# EAGLE design XR_Preamp (EAGLE 7.6.0)

## Sheet 1 of 2
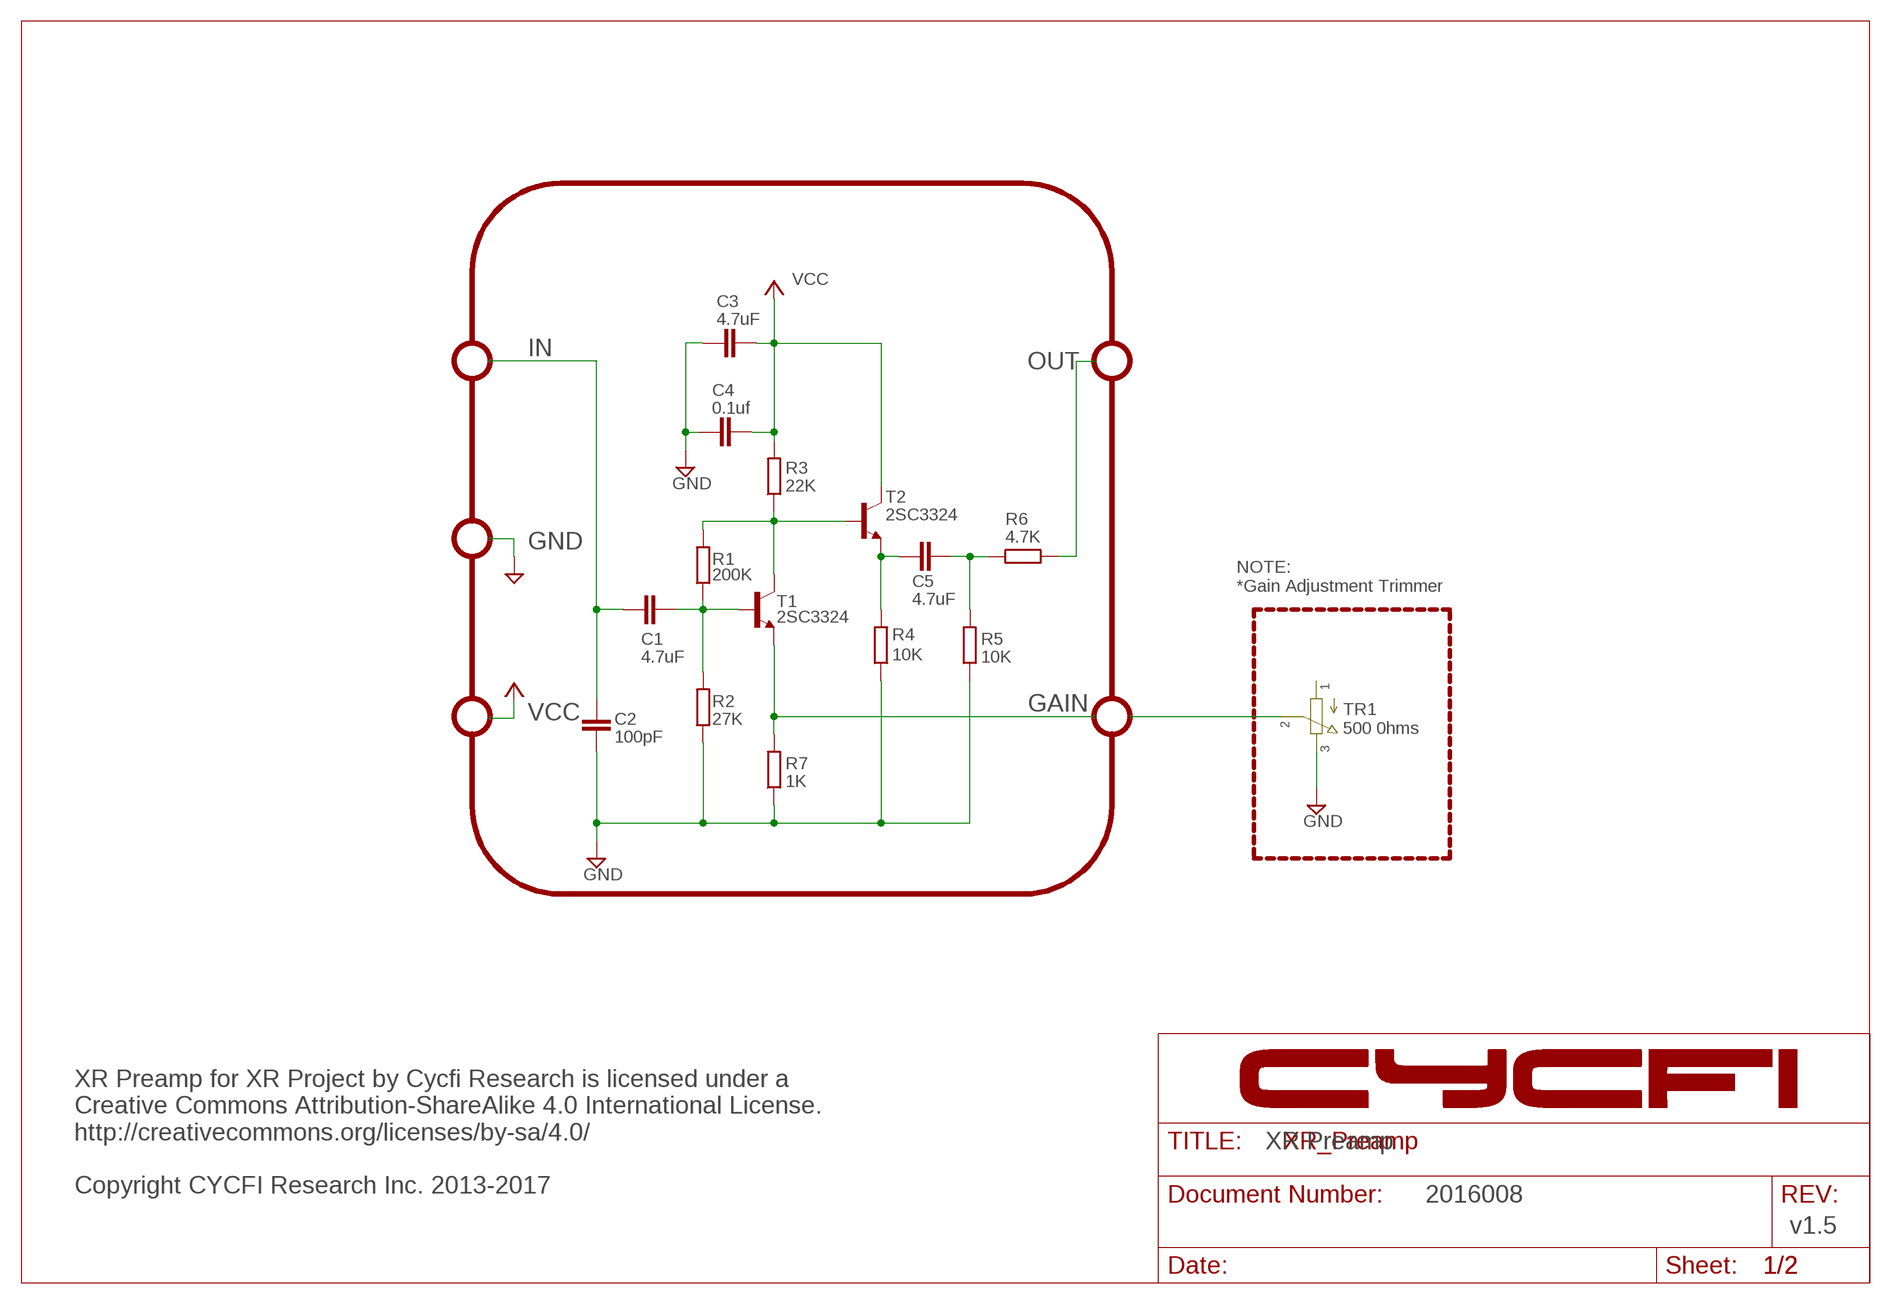
[diagram p0: schematic, sheet 1]

### Parts
C1  4.7uF  C-EUC0603  [C0603]
C2  100pF  C-EUC0402  [C0402]
C3  4.7uF  C-EUC0603  [C0603]
C4  0.1uf  C-EUC0402  [C0402]
C5  4.7uF  C-EUC0402  [C0402]
R1  200K  R-EU_R0402  [R0402]
R2  27K  R-EU_R0402  [R0402]
R3  22K  R-EU_R0402  [R0402]
R4  10K  R-EU_R0402  [R0402]
R5  10K  R-EU_R0402  [R0402]
R6  4.7K  R-EU_R0402  [R0402]
R7  1K  R-EU_R0402  [R0402]
T1  2SC3324  BC846  [SOT23]
T2  2SC3324  BC846  [SOT23]

### Nets
GAIN: R7.2 T1.2(E) ; also sheet 2
GND: C2.1 C3.1 C4.1 R2.1 R4.1 R5.1 R7.1 ; also sheet 2
IN: C1.1 C2.2 ; also sheet 2
N$1: C1.2 R1.1 R2.2 T1.1(B)
N$3: C5.2 R4.2 T2.2(E)
OUT: R6.2 ; also sheet 2
OUT1: C5.1 R5.2 R6.1
VCC: C3.2 C4.2 R3.2 T2.3(C) ; also sheet 2
VCVF: R1.2 R3.1 T1.3(C) T2.1(B)

### Notes on the sheet
- NOTE:
  *Gain Adjustment Trimmer
- 1
- 2
- TR1
  500 0hms
- 3
- XR Preamp
- XR Preamp for XR Project by Cycfi Research is licensed under a
  Creative Commons Attribution-ShareAlike 4.0 International License.
  http://creativecommons.org/licenses/by-sa/4.0/
  
  Copyright CYCFI Research Inc. 2013-2017
- 2016008
- v1.5
- 1/2

## Sheet 2 of 2
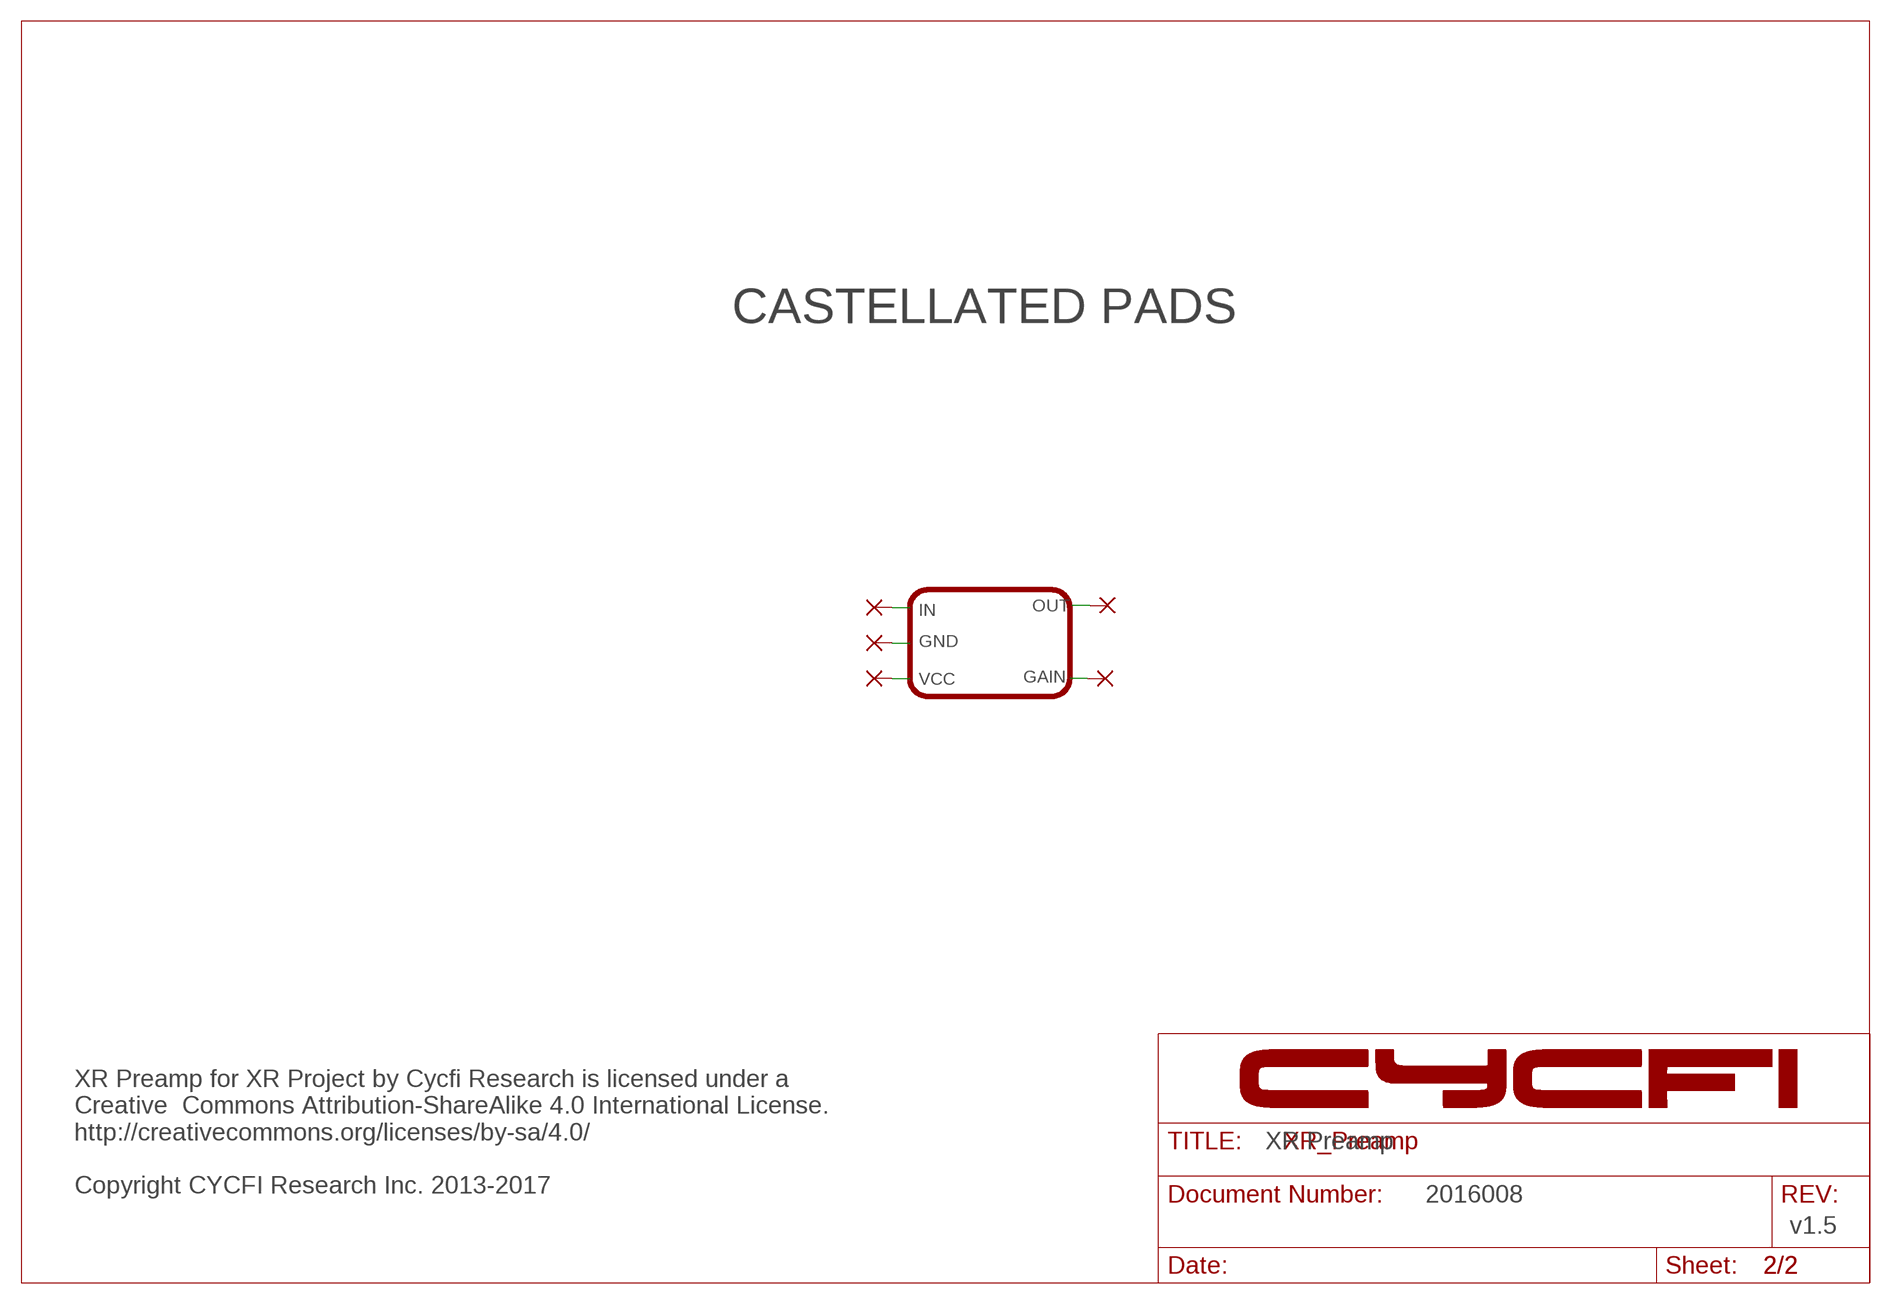
[diagram p1: schematic, sheet 2]

### Parts
PAD1  WIREPAD2,15/1,0  1,6/0,8  [1,6/0,8]
PAD2  WIREPAD2,15/1,0  1,6/0,8  [1,6/0,8]
PAD3  WIREPAD2,15/1,0  1,6/0,8  [1,6/0,8]
PAD4  WIREPAD2,15/1,0  1,6/0,8  [1,6/0,8]
PAD5  WIREPAD2,15/1,0  1,6/0,8  [1,6/0,8]

### Nets
GAIN: PAD1.1(P) ; also sheet 1
GND: PAD2.1(P) ; also sheet 1
IN: PAD3.1(P) ; also sheet 1
OUT: PAD5.1(P) ; also sheet 1
VCC: PAD4.1(P) ; also sheet 1

### Notes on the sheet
- CASTELLATED PADS
- GND
- VCC
- XR Preamp
- XR Preamp for XR Project by Cycfi Research is licensed under a
  Creative  Commons Attribution-ShareAlike 4.0 International License. 
  http://creativecommons.org/licenses/by-sa/4.0/
  
  Copyright CYCFI Research Inc. 2013-2017
- 2016008
- v1.5
- 2/2

## Library data of the parts
C1-C5 = resistor:C-EU: CAPACITOR, European symbol
PAD1-PAD5 = wirepad:1,6/0,8: THROUGH-HOLE PAD
R1-R7 = resistor:R-EU_: RESISTOR, European symbol
T1 T2 = transistor:BC846: NPN TRANSISTOR

## Board
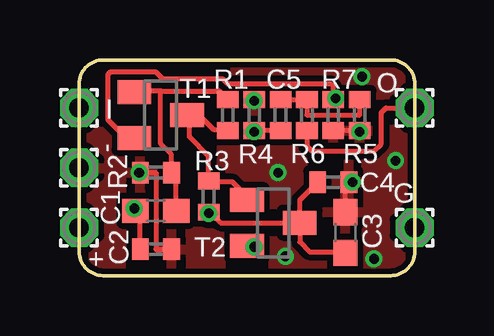
[diagram p2: board, top side]
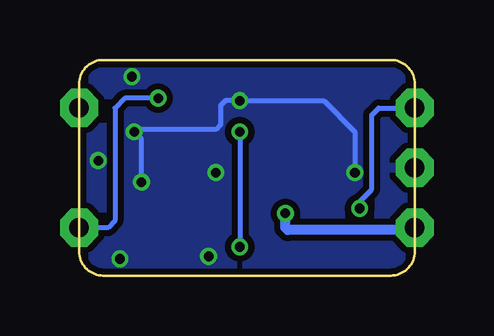
[diagram p3: board, bottom side, seen from below]

Size 14 x 9 mm. Coordinates in mm from the lower left corner, seen from the top.
Outline: 0,8 0,1 arc90 1,0 13,0 arc90 14,1 14,8 arc90 13,9 1,9 arc90 0,8
Copper layers (1*16): Top 0.035mm / dielectric 1.5mm / Bottom 0.035mm
Design rules "Fusion_eagle_rule_v1.1": minimum track width 6mil, minimum drill 12mil, track to track 6mil, track to pad 6mil, pad to pad 6mil, via to via 6mil, smd to smd 0mil, copper to edge 10mil, drill to drill 10mil, minimum pad ring 10mil, minimum via ring 6mil, stop-mask expansion 2mil, vias tented up to drill 100mil, thermal gap 10mil

### Footprints (pad centres in the part's own frame; a part is rotated, then mirrored left to right if it is on the bottom)
C0603 = smd 1.1 x 1: 1 -0.85,0; 2 0.85,0
C0402 = smd 0.7 x 0.9: 1 -0.65,0; 2 0.65,0
1,6/0,8 = drill 0.813 pad 1.6 octagon: 1 0,0
R0402 = smd 0.7 x 0.9: 1 -0.65,0; 2 0.65,0
SOT23 = smd 1 x 1.4: 1 -0.95,-1.1; 2 0.95,-1.1; 3 0,1.1

### Placement (x,y rotation side)
C1  3.2,2.7 0 top
C2  3.2,1.1 180 top
C3  11.1,1.8 270 top
C4  10.6,3.9 180 top
C5  8.4,6.7 270 top
PAD1  14,2 0 top
PAD2  0,4.5 0 top
PAD3  0,7 0 top
PAD4  0,2 0 top
PAD5  14,7 0 top
R1  6.2,6.7 270 top
R2  3.2,4.3 0 top
R3  5.4,3.3 270 top
R4  7.3,6.7 270 top
R5  11.7,6.7 90 top
R6  9.5,6.7 270 top
R7  10.6,6.7 90 top
T1  3.4,6.7 270 top
T2  8.1,2.2 270 top

### Tracks (layer width: path | path; a pad name or v marks a point on that pad's centre or on a via)
GAIN  (via drill 0.4)
  Top 0.203: T1.2 1.95,5.75 1.2,6.5 1.2,8.4 1.3,8.5 3.2,8.5 3.5,8.2 6,8.2 6.2,8 10.5,8 10.6,7.9 10.6,7.5 v10.7,7.4 10.65,7.35 R7.2
  Bottom 0.203: v10.7,7.4 12.1,7.4 12.5,7 12.5,2.3 12.8,2 PAD1.1
GND  (via drill 0.4)
  Top 0.203: C2.1 3.2,1.1 3.2,4.3 R2.1 2.5,4.25 v2.5,4.3 | R4.1 v7.3,7.3 | v11.7,6 11.75,6 R5.1 R7.1 | C3.1 11.1,3.75 C4.1 v11.4,3.9
  Bottom 0.203: v2.5,4.3 2.5,6 3.8,7.3 v7.3,7.3 7.9,7.3 8.1,7.1 8.1,6.3 8.3,6.1 11.6,6.1 v11.7,6 11.4,5.7 11.4,4.9 v11.4,3.9
  other vias: 8.3,4.3 8.6,0.8 12.3,0.7 13.2,4.8 11.8,8.3
  pour Bottom (isolate 0.254): 0,8 0,1 arc90 1,0 13,0 arc90 14,1 14,8 arc90 13,9 1,9 arc90
  pour Top (isolate 0.254): 13,9 1,9 arc90 0,8 0,1 arc90 1,0 13,0 arc90 14,1 14,8 arc90
IN  (via drill 0.4)
  Top 0.203: C2.2 2.55,2.5 C1.1 2.35,2.75 v2.3,2.8
  Bottom 0.203: v2.3,2.8 2.3,3.1 1.8,3.6 1.8,6.7 1.5,7 PAD3.1
N$1
  Top 0.203: C1.2 4.05,4.1 R2.2 3.85,5.05 3.4,5.5 3.4,7.7 | 3.4,7.7 2.35,7.7 T1.1 | 3.4,7.7 5.85,7.7 R1.1
N$3  (via drill 0.4)
  Top 0.203: C5.2 R4.2 v7.3,6 | v7.3,1.2 7.3,0.95 T2.2
  Bottom 0.203: v7.3,6 v7.3,1.2
OUT
  Top 0.203: R6.2 9.5,5.4 9.7,5.2 12.3,5.2 12.6,5.5 12.6,6.8 12.8,7 PAD5.1
OUT1
  Top 0.203: C5.1 R6.1 9.5,6.7 11.7,6.7 R5.2
VCC  (via drill 0.4)
  Top 0.203: R3.2 5.45,2.65 5.9,2.2 T2.3 | T2.3 9.2,3.15 C4.2 | T2.3 9.2,1.4 9.6,1 11.05,1 C3.2
  Top 0.406: v5.4,2.6 R3.2
  Bottom 0.406: v5.4,2.6 5.4,2 5.3,1.9 0.2,1.9 0.1,2 PAD4.1
VCVF
  Top 0.203: R1.2 6.15,6.1 5.6,6.1 5,6.7 T1.3 4.6,6.6 4.6,5.8 5.4,5 R3.1 5.45,3.9 6.4,3.9 7,3.3 T2.1

### Text on the board
tNames: O | I | - | G | +
_tNames: R1 | C5 | R7 | O | I | T1 | - | R4 | R6 | R5 | R2 | R3 | C4 | C3 | G | C1 | T2 | + | C2